# Altium schematic sheet real-time-clock.SchDoc
size 297 x 209 mm
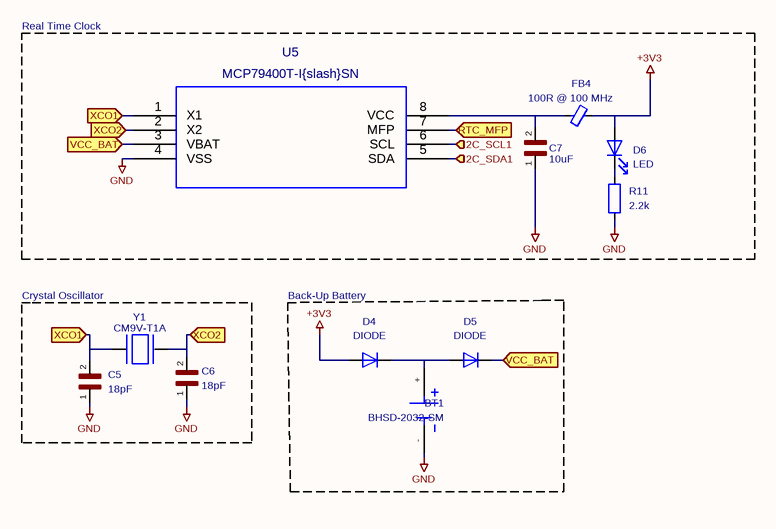
[diagram p0: real-time-clock.SchDoc]

## Parts
BT1  BHSD-2032-SM  [BAT_BHSD-2032-SM]
C5  18pF  [C_0603_1608Metric]
C6  18pF  [C_0603_1608Metric]
C7  10uF  [C_0603_1608Metric]
D4  DIODE  [D_0603_1608Metric]
D5  DIODE  [D_0603_1608Metric]
D6  LED  [LED_0603_1608Metric]
FB4  100R @ 100 MHz  [L_0603_1608Metric]
R11  2.2k  [R_0603_1608Metric]
U5  MCP79400T-I{slash}SN  [MCP79400T-I&slash_SN]
Y1  CM9V-T1A  [XTAL_CM9V-T1A-32.768KHZ-9PF-20PPM-TA-QC]

## Blocks framed on the sheet
Real Time Clock: C7 D6 FB4 R11 U5
Crystal Oscillator: C5 C6 Y1

## Ports
I2C_SCL1 (in), I2C_SDA1 (in), RTC_MFP (in), VCC_BAT (in), XCO1 (in), XCO2 (in)

## Nets
+3V3: D4.1(A) D6.2(A) FB4.1
GND: BT1.- C5.1 C6.1 C7.1 R11.2 U5.4(VSS)
I2C_SCL1: U5.6(SCL) ; port I2C_SCL1
I2C_SDA1: U5.5(SDA) ; port I2C_SDA1
RTC_MFP: U5.7(MFP) ; port RTC_MFP
VCC_BAT: D5.2(K) U5.3(VBAT) ; port VCC_BAT
XCO1: C5.2 U5.1(X1) Y1.1 ; port XCO1
XCO2: C6.2 U5.2(X2) Y1.2 ; port XCO2
NetBT1_+: BT1.+ D4.2(K) D5.1(A)
NetC7_2: C7.2 FB4.2 U5.8(VCC)
NetD6_1: D6.1(K) R11.1

## Notes on the sheet
- Back-Up Battery
- 1
- 2
- 3
- 4
- 5
- 6
- A
- B
- C
- D
- Title:
- File: real-time-clock.kicad_sch
- Sheet: /
- KiCad E.D.A.  kicad (5.1.4)-1
- Size: A4
- Date:
- Rev:
- Id: 1/1

## Library data of the parts
BT1 = BVSD-2032-PC: MANUFACTURER: Memory Protection Devices, Inc.; MAXIMUM_PACKAGE_HEIGHT: 28.19 mm; STANDARD: Manufacturer Recommendations; PARTREV: D; Value: BHSD-2032-SM; Footprint: qset-footprints:BAT_BHSD-2032-SM
C5-C7 = CL10B104KB8NNNL: Footprint: Capacitor_SMD:C_0603_1608Metric
  C5 C6: Value: 18pF
  C7: Value: 10uF
FB4 = FerriteBead_Small: Value: 100R @ 100 MHz; Footprint: Inductor_SMD:L_0603_1608Metric
R11 = R: Value: 2.2k; Footprint: Resistor_SMD:R_0603_1608Metric
U5 = MCP79400T-I{brace}slash}SN: Value: MCP79400T-I{slash}SN; Footprint: qset-footprints:MCP79400T-I&slash_SN
Y1 = CM9V-T1A-32.768KHZ-9PF-20PPM-TA-QC: MANUFACTURER: Micro Crystal; PARTREV: 8.0/10.2016; STANDARD: Manufacturer Recommendations; MAXIMUM_PACKAGE_HEIGHT: 0.5 mm; Value: CM9V-T1A; Footprint: qset-footprints:XTAL_CM9V-T1A-32.768KHZ-9PF-20PPM-TA-QC
D4 D5 = DIODE: Spice_Netlist_Enabled: Y; Spice_Primitive: D; Value: DIODE; Footprint: Diode_SMD:D_0603_1608Metric
D6 = LED: Value: LED; Footprint: LED_SMD:LED_0603_1608Metric